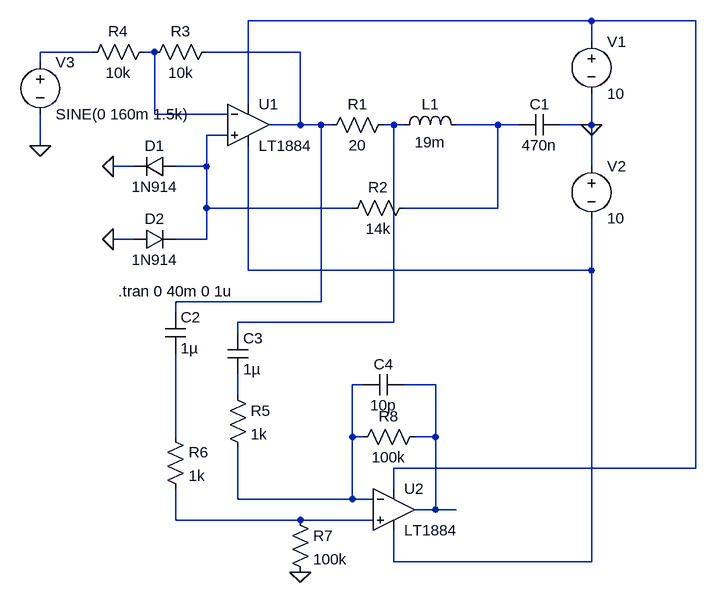
[diagram p0: schematic Duffing_Holmes.asc]
Duffing_Holmes.asc, the LTspice schematic file:
Version 4
SHEET 1 1092 836
WIRE 544 -32 16 -32
WIRE 704 -32 544 -32
WIRE 544 0 544 -32
WIRE -224 16 -304 16
WIRE -128 16 -144 16
WIRE 96 16 -48 16
WIRE -304 32 -304 16
WIRE 16 96 16 -32
WIRE -128 112 -128 16
WIRE -16 112 -128 112
WIRE 96 128 96 16
WIRE 96 128 48 128
WIRE 128 128 96 128
WIRE 144 128 128 128
WIRE 240 128 224 128
WIRE 256 128 240 128
WIRE 400 128 336 128
WIRE 432 128 400 128
WIRE 544 128 544 80
WIRE 544 128 496 128
WIRE 560 128 544 128
WIRE -16 144 -48 144
WIRE -304 160 -304 112
WIRE -160 192 -192 192
WIRE -48 192 -48 144
WIRE -48 192 -96 192
WIRE 544 192 544 128
WIRE -48 256 -48 192
WIRE 176 256 -48 256
WIRE 400 256 400 128
WIRE 400 256 256 256
WIRE -160 304 -192 304
WIRE -48 304 -48 256
WIRE -48 304 -96 304
WIRE 16 352 16 160
WIRE 544 352 544 272
WIRE 544 352 16 352
WIRE 128 400 128 128
WIRE 128 400 -96 400
WIRE -96 416 -96 400
WIRE 240 432 240 128
WIRE 240 432 0 432
WIRE 0 448 0 432
WIRE 192 528 176 528
WIRE 304 528 256 528
WIRE 0 544 0 512
WIRE -96 608 -96 480
WIRE 176 608 176 528
WIRE 192 608 176 608
WIRE 304 608 304 528
WIRE 304 608 272 608
WIRE 704 656 704 -32
WIRE 704 656 240 656
WIRE 240 688 240 656
WIRE 0 704 0 624
WIRE 176 704 176 608
WIRE 176 704 0 704
WIRE 208 704 176 704
WIRE 304 720 304 608
WIRE 304 720 272 720
WIRE 336 720 304 720
WIRE -96 736 -96 688
WIRE 96 736 -96 736
WIRE 208 736 96 736
WIRE 240 800 240 752
WIRE 544 800 544 352
WIRE 544 800 240 800
FLAG -192 192 0
FLAG -192 304 0
FLAG -304 160 0
FLAG 544 128 0
FLAG 96 816 0
SYMBOL ind 240 144 R270
WINDOW 0 32 56 VTop 2
WINDOW 3 5 56 VBottom 2
SYMATTR InstName L1
SYMATTR Value 19m
SYMBOL cap 496 112 R90
WINDOW 0 0 32 VBottom 2
WINDOW 3 32 32 VTop 2
SYMATTR InstName C1
SYMATTR Value 470n
SYMBOL res 128 144 R270
WINDOW 0 32 56 VTop 2
WINDOW 3 0 56 VBottom 2
SYMATTR InstName R1
SYMATTR Value 20
SYMBOL voltage 544 -16 R0
WINDOW 123 0 0 Left 2
WINDOW 39 0 0 Left 2
SYMATTR InstName V1
SYMATTR Value 10
SYMBOL voltage 544 176 R0
WINDOW 123 0 0 Left 2
WINDOW 39 0 0 Left 2
SYMATTR InstName V2
SYMATTR Value 10
SYMBOL res 160 272 R270
WINDOW 0 32 56 VTop 2
WINDOW 3 0 56 VBottom 2
SYMATTR InstName R2
SYMATTR Value 14k
SYMBOL res -144 32 R270
WINDOW 0 32 56 VTop 2
WINDOW 3 0 56 VBottom 2
SYMATTR InstName R3
SYMATTR Value 10k
SYMBOL res -240 32 R270
WINDOW 0 32 56 VTop 2
WINDOW 3 0 56 VBottom 2
SYMATTR InstName R4
SYMATTR Value 10k
SYMBOL diode -96 176 R90
WINDOW 0 0 32 VBottom 2
WINDOW 3 32 32 VTop 2
SYMATTR InstName D1
SYMATTR Value 1N914
SYMBOL diode -160 288 M90
WINDOW 0 0 32 VBottom 2
WINDOW 3 32 32 VTop 2
SYMATTR InstName D2
SYMATTR Value 1N914
SYMBOL Opamps\\LT1884 16 64 R0
SYMATTR InstName U1
SYMBOL voltage -304 16 R0
WINDOW 123 0 0 Left 2
WINDOW 39 0 0 Left 2
SYMATTR InstName V3
SYMATTR Value SINE(0 160m 1.5k)
SYMBOL Opamps\\LT1884 240 656 R0
SYMATTR InstName U2
SYMBOL cap -112 416 R0
SYMATTR InstName C2
SYMATTR Value 1µ
SYMBOL cap -16 448 R0
SYMATTR InstName C3
SYMATTR Value 1µ
SYMBOL res -16 528 R0
SYMATTR InstName R5
SYMATTR Value 1k
SYMBOL res -112 592 R0
SYMATTR InstName R6
SYMATTR Value 1k
SYMBOL res 80 720 R0
SYMATTR InstName R7
SYMATTR Value 100k
SYMBOL res 288 592 R90
WINDOW 0 0 56 VBottom 2
WINDOW 3 32 56 VTop 2
SYMATTR InstName R8
SYMATTR Value 100k
SYMBOL cap 256 512 R90
WINDOW 0 0 32 VBottom 2
WINDOW 3 32 32 VTop 2
SYMATTR InstName C4
SYMATTR Value 10p
TEXT -184 384 Left 2 !.tran 0 40m 0 1u

The netlist it stands for:
* Duffing_Holmes.asc
L1 N005 N006 19m
C1 0 N006 470n
R1 N004 N005 20
V1 N001 0 10
V2 0 N008 10
R2 N007 N006 14k
R3 N003 N004 10k
R4 N002 N003 10k
D1 N007 0 1N914
D2 0 N007 1N914
XU1 N007 N003 N001 N008 N004 LT1884  ; pins In+ In- V+ V- OUT
V3 N002 0 SINE(0 160m 1.5k)
XU2 N013 N009 N001 N008 N010 LT1884  ; pins In+ In- V+ V- OUT
C2 N004 N012 1µ
C3 N005 N011 1µ
R5 N011 N009 1k
R6 N012 N013 1k
R7 N013 0 100k
R8 N010 N009 100k
C4 N010 N009 10p
.model D D
.lib standard.dio
.tran 0 40m 0 1u
.backanno
.end